# EAGLE design 103_Button_Rev020000 (EAGLE 9.6.2)
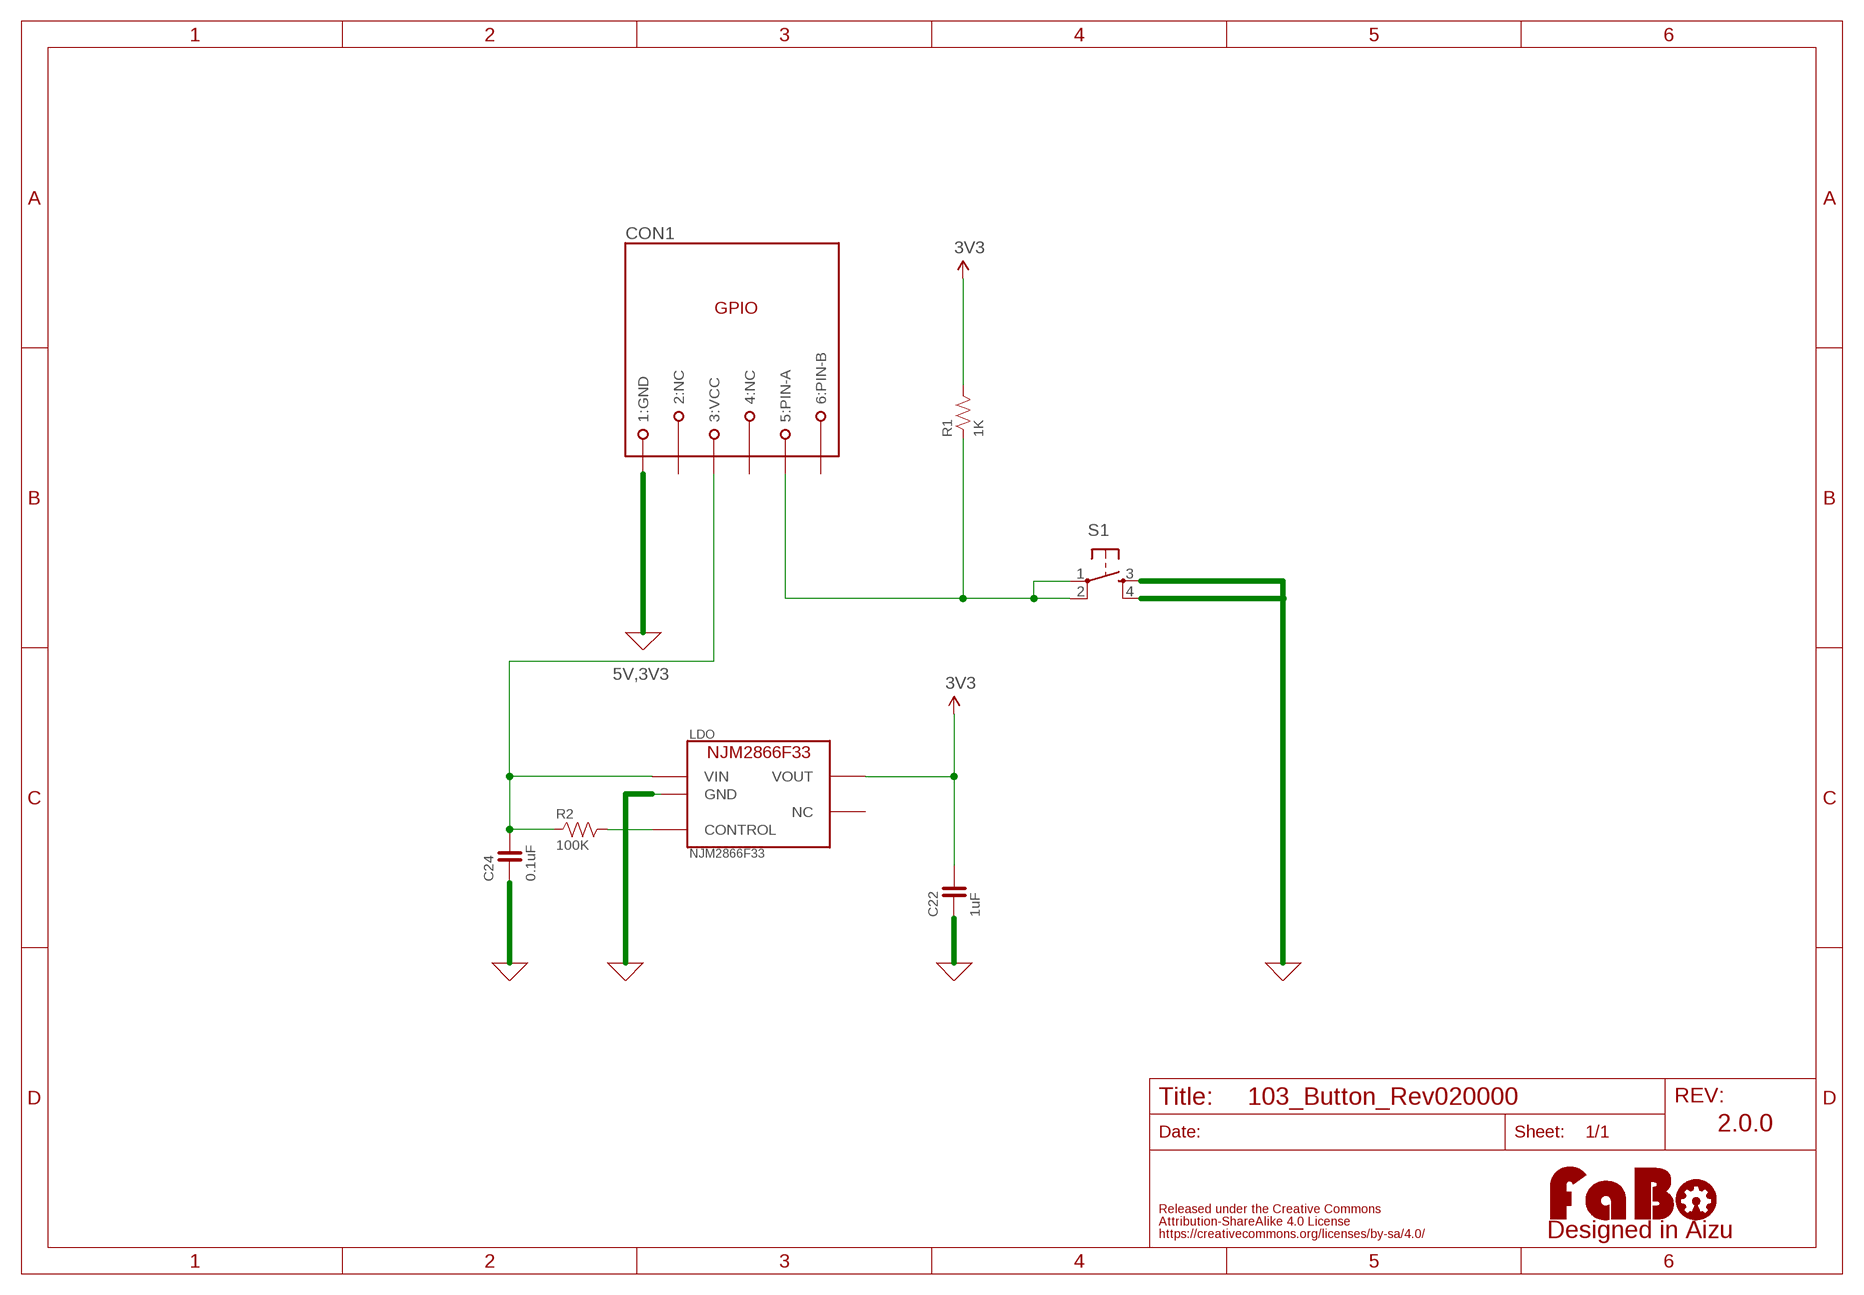
[diagram p0: schematic, sheet 1]

## Parts
C22  1uF  CAPACITOR-0603  [0603]
C24  0.1uF  CAPACITOR-0603  [0603]
CON1  MODULAR-JACK-6P-RJ11_GPIO  [7002-6PXC-X]
LDO  NJM2866F33  [SOT-23-5]
LOGO1  LOGO_FABO-M_BOTTOM  [LOGO_FABO_M_BOTTOM]
R1  1K  RESISTOR-0603  [0603]
R2  100K  RESISTOR-0603  [0603]
S1  TACT-SWITCH-12MM  [1273HA-160G-G]

## Nets
0: C22.1 C24.1 CON1.1(1:GND) LDO.2(GND) S1.3 S1.4 ; supply symbol labelled GND
3V3: C22.2 LDO.5(VOUT) R1.2
5V,3V3: C24.2 CON1.3(3:VCC) LDO.1(VIN) R2.1
N$1: CON1.5(5:PIN-A) R1.1 S1.1 S1.2
N$2: LDO.3(CONTROL) R2.2
Unconnected: CON1.2(2:NC) CON1.4(4:NC) CON1.6(6:PIN-B) LDO.4(NC)

## Notes on the sheet
- 2.0.0

## Library data of the parts
C22 C24 = FaBo-Capacitor:CAPACITOR: CAPACITOR
CON1 = FaBo-Connetor:MODULAR-JACK-6P-RJ11_GPIO
LDO = FaBo-Supply:NJM2866F33: LDO Voltage Regulator Output Voltage 3.3 V Output Current 130 mA Quiescent Current 180 uA Input Voltage2.3 V ~ 14V Dropout 100 mV - 40 C~+ 85 C RoHS SOT-23-5
LOGO1 = component:LOGO_FABO
R1 R2 = FaBo-Resistors:RESISTOR: RESISTOR
S1 = FaBo-Switch:TACT-SWITCH

## Board
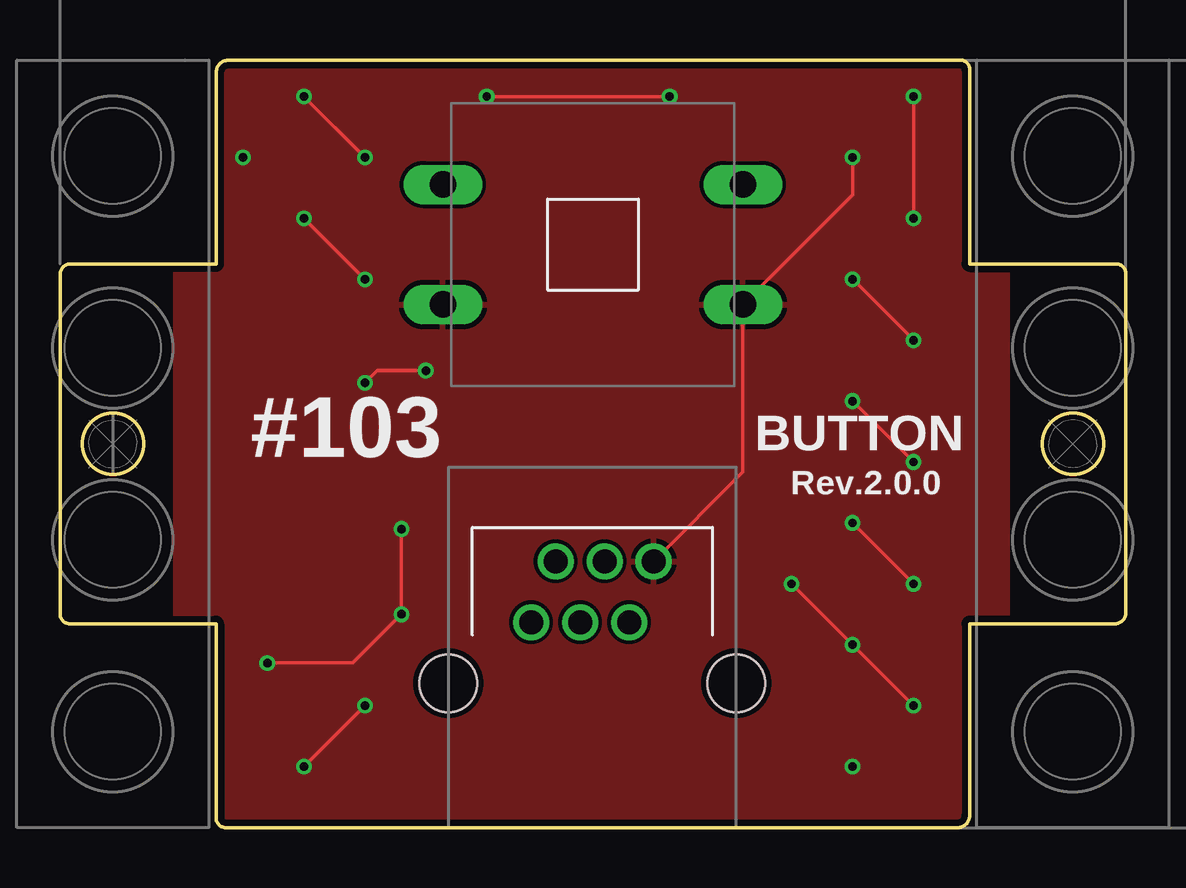
[diagram p1: board, top side]
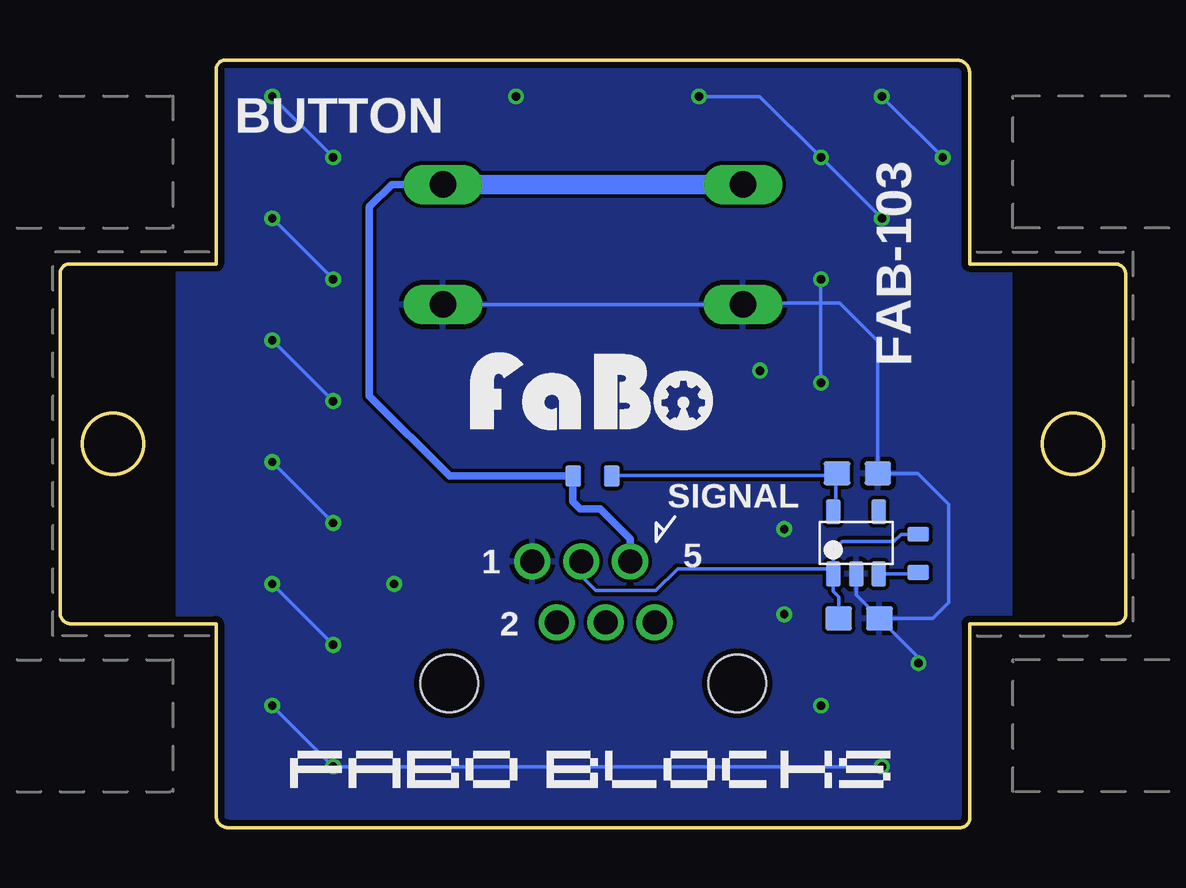
[diagram p2: board, bottom side, seen from below]

Size 44.41 x 32 mm. Coordinates in mm from the lower left corner, seen from the top.
Outline: 37.4,0 6.9,0 arc-90 6.5,0.4 6.5,8.5 0.4,8.5 arc-90 0,8.9 0,23 arc-90 0.4,23.5 6.5,23.5 6.5,31.5 arc-90 7.1,32 37.5,32 arc-90 37.9,31.6 37.9,23.5 44,23.5 arc-90 44.4,23.1 44.4,9 arc-90 44,8.5 37.9,8.5 37.9,0.5 arc-90 37.4,0
Outline: circle at 42.2,16 radius 1.27
Outline: circle at 2.2,16 radius 1.27
Copper layers (1*16): Top 0.035mm / dielectric 1.6mm / Bottom 0.035mm
Design rules "PCBway": minimum track width 6mil, minimum drill 12mil, track to track 6mil, track to pad 6mil, pad to pad 6mil, via to via 6mil, smd to smd 6mil, copper to edge 10mil, drill to drill 10mil, minimum pad ring 10mil, minimum via ring 6mil, stop-mask expansion 2mil, vias tented up to drill 100mil, thermal gap 8mil
tRestrict: area -1.2,7.3 to 4.7,24.4; area 39.6,7.5 to 45.5,24.6
bRestrict: area -1.2,7.3 to 4.7,24.4; area 39.6,7.6 to 45.5,24.7

### Footprints (pad centres in the part's own frame; a part is rotated, then mirrored left to right if it is on the bottom)
0603 = smd 1.1 x 1: 1 -0.85,0; 2 0.85,0
7002-6PXC-X = drill 1: 1 2.55,5.08; 2 1.53,2.54; 3 0.51,5.08; 4 -0.51,2.54; 5 -1.53,5.08; 6 -2.55,2.54 | hole 2.4: -6,0; 6,0
SOT-23-5 = smd 0.6 x 1.05: 1 -0.95,-1.3; 2 0,-1.3; 3 0.95,-1.3; 4 0.95,1.3; 5 -0.95,1.3
0603' = smd 0.65 x 0.9: 1 -0.8,0; 2 0.8,0
1273HA-160G-G = drill 1.1 long: 1 -6.25,2.5; 2 6.25,2.5; 3 -6.25,-2.5; 4 6.25,-2.5

### Placement (x,y rotation side)
C22  11.18,14.77 180 bottom
C24  11.11,8.72 180 bottom
CON1  22.18,6.02 0 top
LDO  11.23,11.87 0 bottom
LOGO1  22.24,16.2 0 top
R1  1K  [0603']  22.21,14.66 0 bottom
R2  100K  [0603']  8.64,11.43 270 bottom
S1  22.2,24.31 0 top
U$2  [4-1BLOCK]  2.2,16 0 top
U$4  [4-1BLOCK]  42.2,16 180 top

### Tracks (layer width: path | path; a pad name or v marks a point on that pad's centre or on a via)
0  (via drill 0.35)
  Top 0.152: CON1.1 28.45,14.82 S1.4 33.02,26.38 v33.02,27.94 | v12.7,22.86 v10.16,25.4 | v12.7,27.94 v10.16,30.48 | v35.56,30.48 v35.56,25.4 | v33.02,22.86 v35.56,20.32 | v33.02,17.78 v35.56,15.24 | v33.02,12.7 v35.56,10.16 | v35.56,5.08 v33.02,7.62 v30.48,10.16 | v10.16,2.54 v12.7,5.08 | v17.78,30.48 v25.4,30.48 | v8.64,6.86 12.19,6.86 v14.23,8.89 v14.23,12.45 | v12.7,18.54 13.21,19.05 v15.24,19.05
  Bottom 0.152: 12.7,21.87 11.91,21.87 10.33,20.29 C22.1 8.68,14.77 7.37,13.46 7.37,9.4 8.05,8.72 C24.1 | 12.7,21.87 15.89,21.87 S1.3 S1.4 | LDO.2 11.23,9.69 C24.1 | 12.7,21.87 v12.7,22.86 | v10.16,25.4 v12.7,27.94 15.24,30.48 v17.78,30.48 | v10.16,30.48 v7.62,27.94 | v33.02,27.94 v35.56,30.48 | v35.56,25.4 v33.02,22.86 | v35.56,20.32 v33.02,17.78 | v35.56,15.24 v33.02,12.7 | v35.56,10.16 v33.02,7.62 | v35.56,5.08 v33.02,2.54 v10.16,2.54 | C24.1 8.64,7.1 v8.64,6.86 | 12.7,21.87 v12.7,18.54
  pour Bottom (rank 6): -4.48,-1.83 48.84,-1.83 48.84,34.63 -4.48,34.63
  pour Top (rank 6): -4.12,-1.1 47.41,-1.1 47.41,33.7 -4.12,33.7
3V3
  Bottom 0.152: 12.09,14.67 12.09,14.71 C22.2 | R1.2 12.09,14.67 | LDO.5 12.09,13.27 12.09,14.67
5V,3V3
  Bottom 0.152: CON1.3 22.69,10.49 22.08,9.88 19.58,9.88 18.67,10.79 12.18,10.79 | 12.18,10.79 12.18,11.55 11.81,11.92 9.67,11.92 9.36,12.23 R2.1 | 12.18,10.79 LDO.1 12.18,9.84 11.96,9.62 C24.2
N$1
  Bottom 0.305: S1.2 30.58,26.81 31.51,25.88 31.51,18 28.17,14.66 R1.1 23.03,14.64 23.03,13.59 22.72,13.28 21.9,13.28 20.65,12.03 CON1.5
  Bottom 0.813: S1.1 S1.2
N$2
  Bottom 0.152: LDO.3 8.7,10.57 R2.2

### Text on the board
tPlace: BUTTON | #103 | Rev.2.0.0
bPlace: BUTTON | FAB-103 | SIGNAL | 5 | 1 | 2
tDocu: #103 BUTTON Rev2.0.0 / 2023/02/10